# EAGLE schematic espnative-deadrail-2-1 (EAGLE 7.5.0)
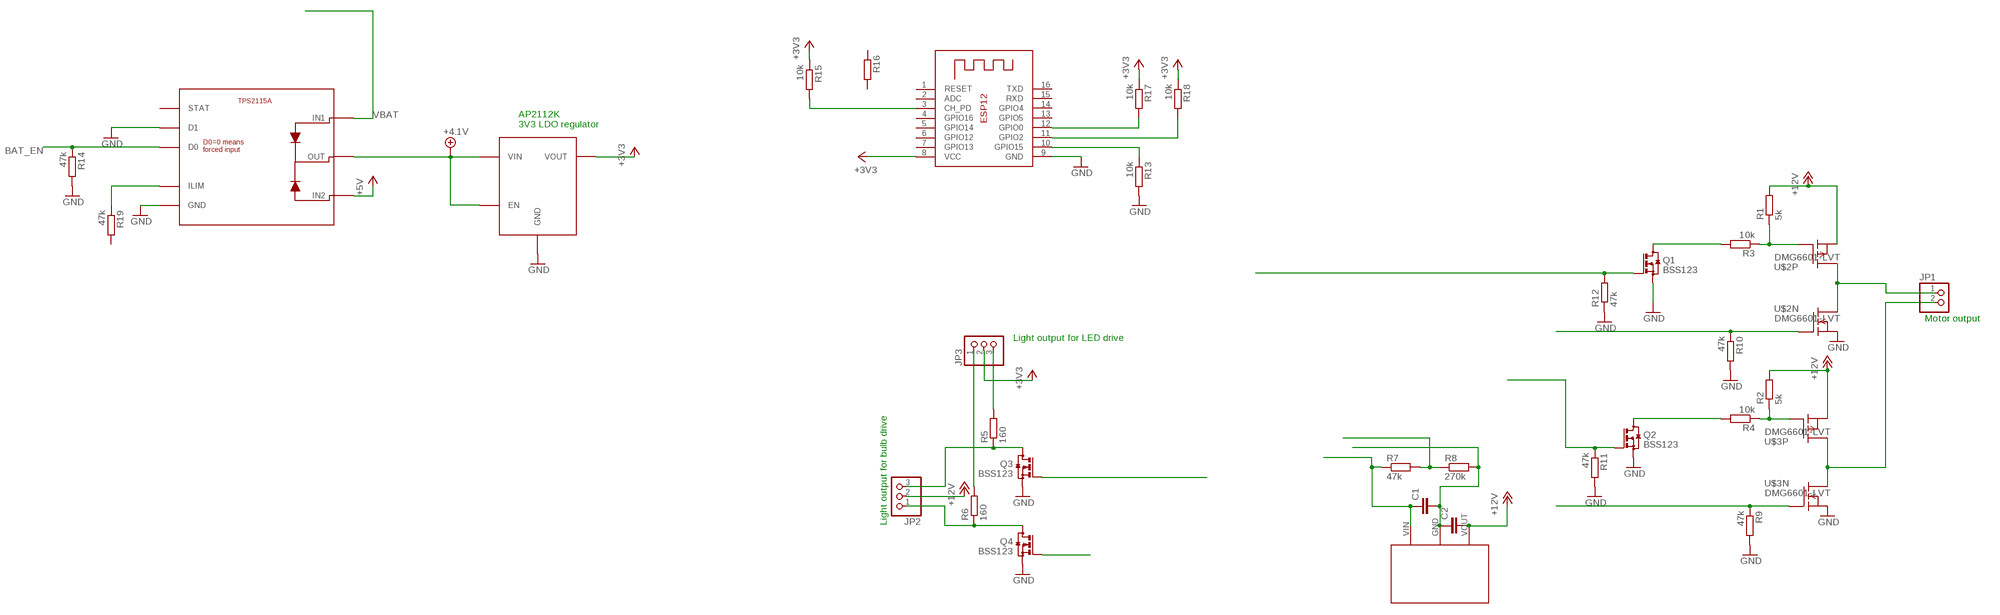
[diagram p0: schematic, sheet 1]

## Parts
C1  C-EUC1210  [C1210]
C2  C-EUC1210  [C1210]
JP1  PINHD-1X2  [1X02]
JP2  PINHD-1X3  [1X03]
JP3  PINHD-1X3  [1X03]
Q1  BSS123  [SOT23]
Q2  BSS123  [SOT23]
Q3  BSS123  [SOT23]
Q4  BSS123  [SOT23]
R1  5k  R-EU_R0805  [R0805]
R2  5k  R-EU_R0805  [R0805]
R3  10k  R-EU_R0805  [R0805]
R4  10k  R-EU_R0805  [R0805]
R5  160  R-EU_R0805  [R0805]
R6  160  R-EU_R0805  [R0805]
R7  47k  R-EU_R0805  [R0805]
R8  270k  R-EU_R0805  [R0805]
R9  47k  R-EU_R0805  [R0805]
R10  47k  R-EU_R0805  [R0805]
R11  47k  R-EU_R0805  [R0805]
R12  47k  R-EU_R0805  [R0805]
R13  10k  R-EU_R0603  [R0603]
R14  47k  R-EU_R0603  [R0603]
R15  10k  R-EU_R0603  [R0603]
R16  R-EU_R0603  [R0603]
R17  10k  R-EU_R0603  [R0603]
R18  10k  R-EU_R0603  [R0603]
R19  47k  R-EU_R0603  [R0603]
U$1  AP2112K-3V3  AP2112K  [SOT23-5L]
U$2  DMG6601-LVT  [TSOT-26]
U$3  DMG6601-LVT  [TSOT-26]
U$4  TPS2115A  [TSSOP-8]
U$5  POLOLU-VREG12  [POLOLU-REGULATOR]
X1  ESP-12  [ESP-12]

## Nets
+3V3: JP3.2 R15.1 R17.1 R18.1 U$1.5(VOUT) X1.8(VCC)
+4.1V: U$1.1(VIN) U$1.3(EN) U$4.7(OUT)
+5V: U$4.6(IN2)
+12V: C2.2 JP2.2 R1.2 R2.2 U$2.2(P:S) U$3.2(P:S) U$5.VOUT
BAT_EN: R14.1 U$4.2(D0)
GND: C1.2 C2.1 Q1.2(S) Q2.2(S) Q3.2(S) Q4.2(S) R8.2 R9.2 R10.2 R11.2 R12.1 R13.2 R14.2 U$1.2(GND) U$2.5(N:S) U$3.5(N:S) U$4.3(D1) U$4.5(GND) U$5.GND X1.9(GND)
N$1: JP1.1 U$2.4(P:D) U$2.6(N:D)
N$2: R1.1 R3.1 U$2.3(P:G)
N$3: Q2.3(D) R4.2
N$4: R2.1 R4.1 U$3.3(P:G)
N$5: Q1.1(G) R12.2
N$6: Q1.3(D) R3.2
N$7: JP1.2 U$3.4(P:D) U$3.6(N:D)
N$8: R10.1 U$2.1(N:G)
N$9: Q2.1(G) R11.1
N$10: R9.1 U$3.1(N:G)
N$11: Q3.1(G)
N$12: Q4.1(G)
N$13: JP2.3 Q3.3(D) R5.1
N$14: JP2.1 Q4.3(D) R6.1
N$15: JP3.3 R5.2
N$16: JP3.1 R6.2
N$17: R15.2 X1.3(CH_PD)
N$18: R17.2 X1.12(GPIO0)
N$19: R7.2 R8.1
N$20: R18.2 X1.11(GPIO2)
N$21: R13.1 X1.10(GPIO15)
N$22: R19.1 U$4.4(ILIM)
VBAT: C1.1 R7.1 U$4.8(IN1) U$5.VIN
Unconnected: R16.1 R16.2 R19.2 U$4.1(STAT) X1.1(RESET) X1.2(ADC) X1.4(GPIO16) X1.5(GPIO14) X1.6(GPIO12) X1.7(GPIO13) X1.13(GPIO5) X1.14(GPIO4) X1.15(RXD) X1.16(TXD)

## Notes on the sheet
- AP2112K
  3V3 LDO regulator
- Motor output
- Light output for LED drive
- Light output for bulb drive

## Library data of the parts
C1 C2 = rcl:C-EU: CAPACITOR, European symbol
JP1 = pinhead:PINHD-1X2: PIN HEADER
JP2 JP3 = pinhead:PINHD-1X3: PIN HEADER
Q1-Q4 = transistor-small-signal:BSS123: N-CHANNEL MOS FET
R1-R19 = rcl:R-EU_: RESISTOR, European symbol
U$1 = trainlib:AP2112: 600mA CMOS LDO regulator with enable http://www.diodes.com/_files/datasheets/AP2112.pdf http://www.digikey.com/product-detail/en/diodes-incorporated/AP2112K-3.3TRG1/AP2112K-3.3TRG1DICT-ND/4505257 Package includes sot23-5.
U$2 U$3 = trainlib:DMG6601-LVT: Dual N+P-channel MOSFET. Package: TSOT-26 Vmax=30V N-channel: 55mOhm, 3.8A Imax P-channel: 110mOhm, 2.5A Imax
U$4 = trainlib:TPS2115A: Power source select Ideal diode pair selects power source from two alternatives. Truth table: D0=0 selects fixed input. (D1=0 sleects IN2, D1=1 selects IN1) D0=1 selects auto-input. (D1=0 picks higher voltage, D1=1 sets shutdown) http://www.ti.com/lit/ds/symlink/tps2114a.pdf
U$5 = trainlib:POLOLU-VREG12
X1 = adafruit:ESP-12